# Altium schematic sheet Sensor.SchDoc
size A3; SheetNumber: 4; SheetTotal: 7
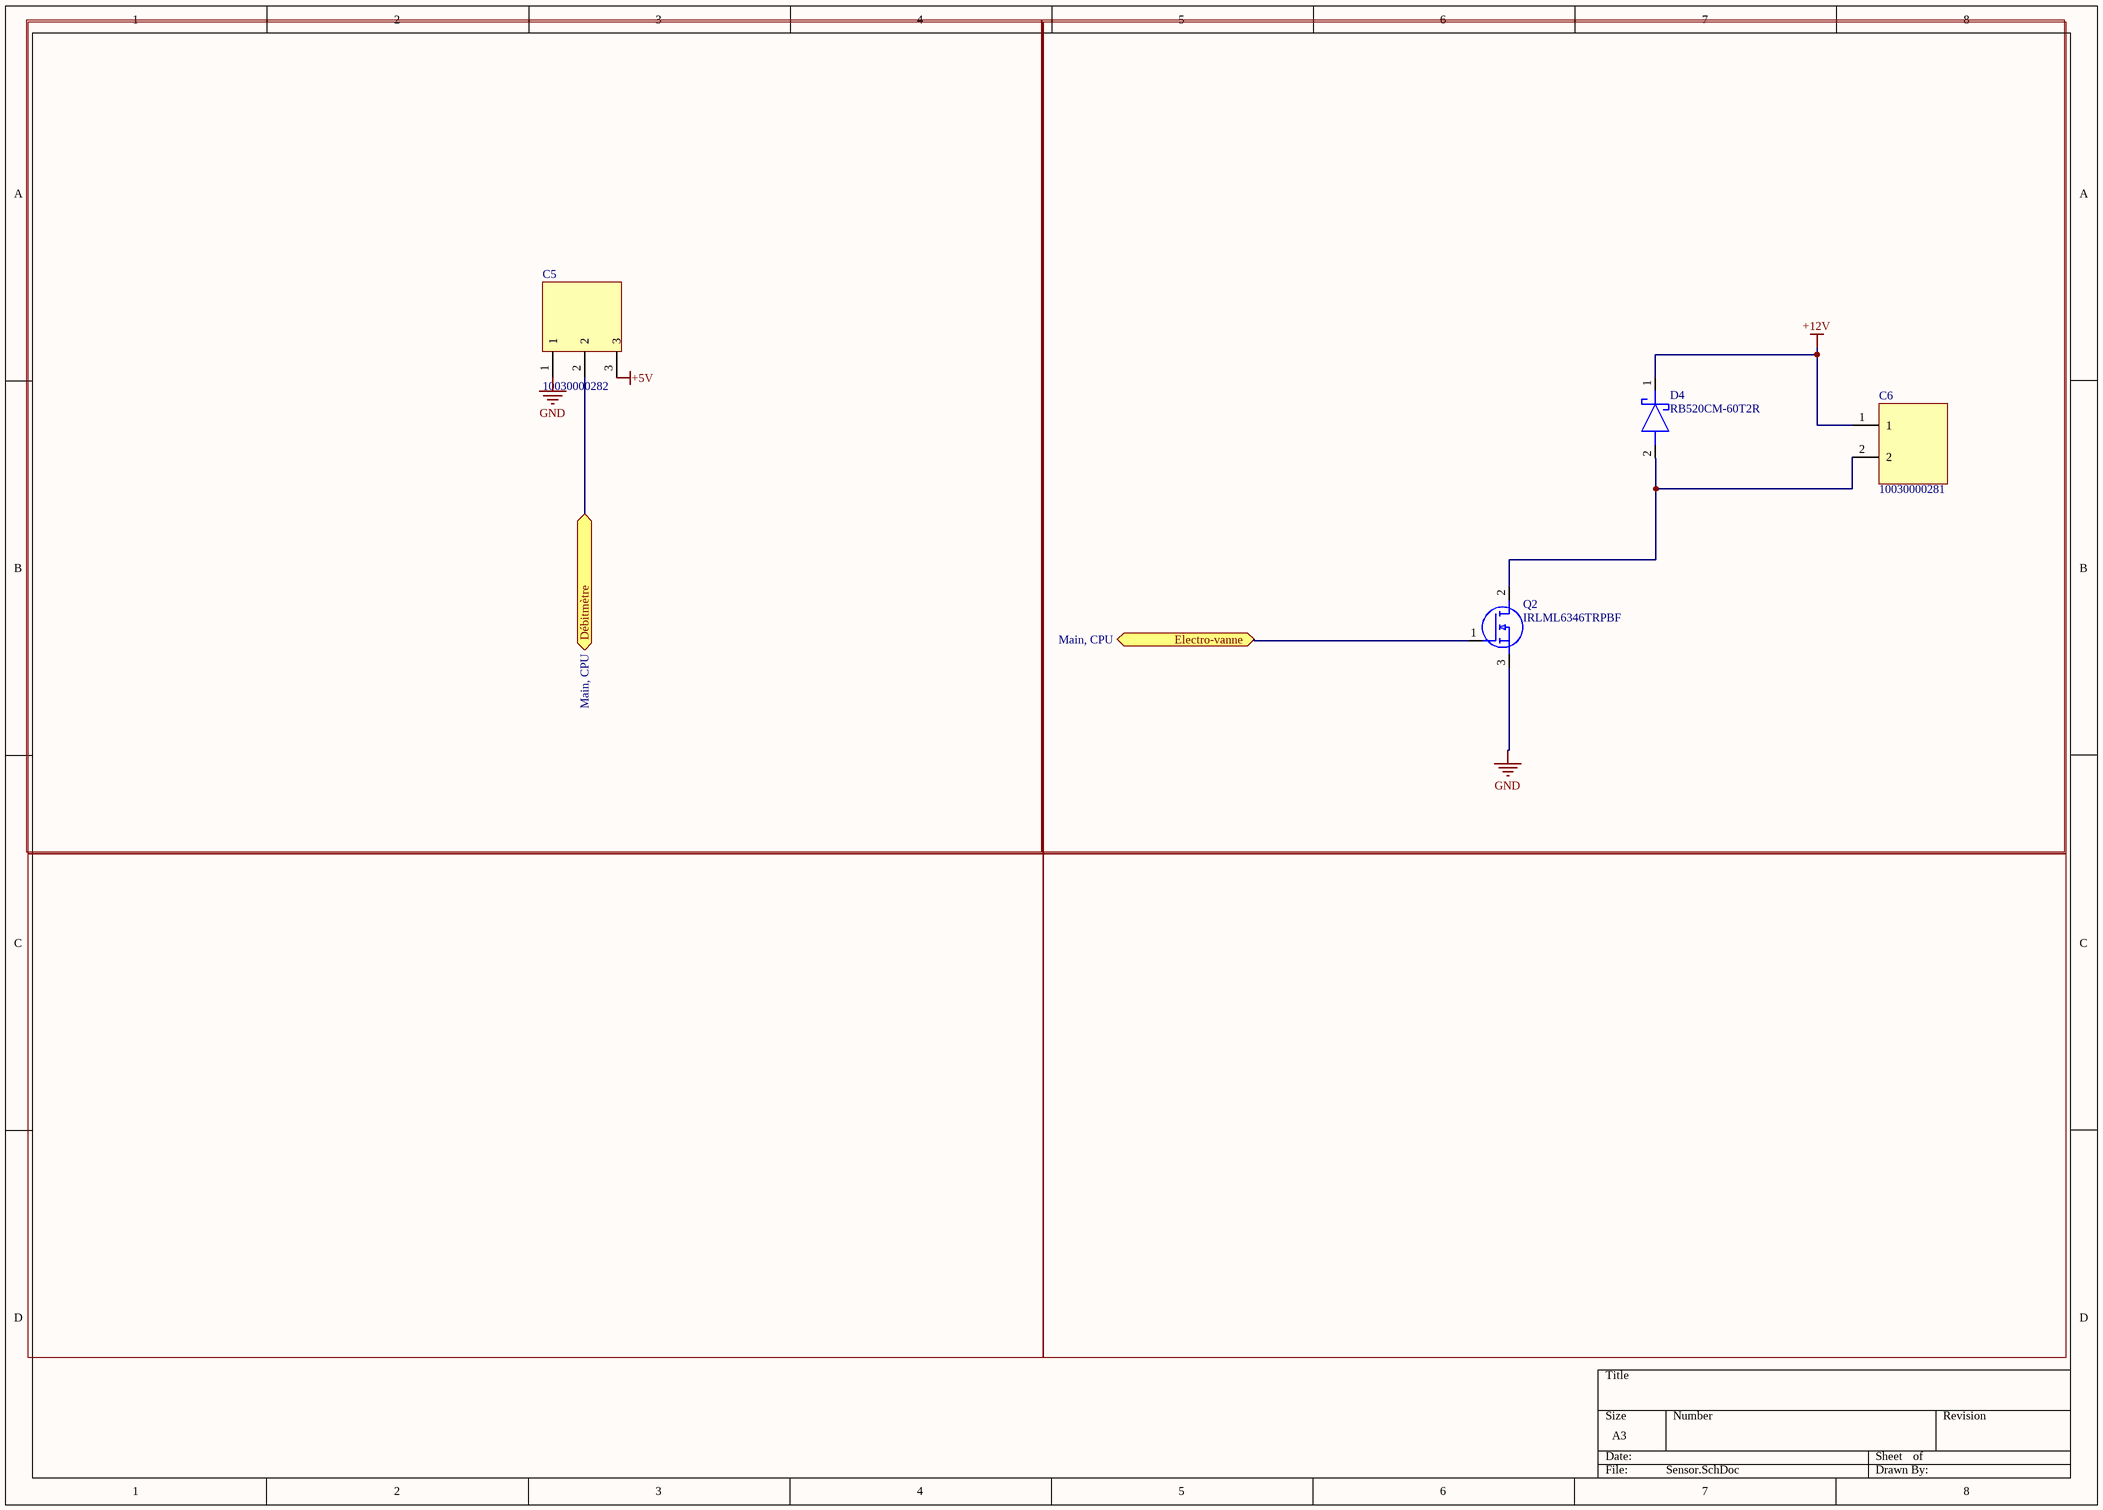
[diagram p0: Sensor.SchDoc]

## Parts
C5  10030000282  [15EDGRC-5.08-03P-10030000282]
C6  10030000281  [5EDGRHC-7.62-02P-10020000939]
D4  RB520CM-60T2R  [1SS400CSFHT2RA]
Q2  IRLML6346TRPBF  [SOT95P237X112-3N]

## Ports
Débitmètre (bidir, see Main, CPU), Electro-vanne (bidir, see Main, CPU)

## Nets
+5V: C5.3
+12V: C6.1 D4.1(K)
GND: C5.1 Q2.3(S)
Débitmètre: C5.2 ; port Débitmètre
Electro-vanne: Q2.1(G) ; port Electro-vanne
NetC6_2: C6.2 D4.2(A) Q2.2(D)

## Library data of the parts
C5 = 15EDGRC-5.08-03P: Pluggable Terminal Blocksnominal current7A.Rated voltage(Ⅱ/2)：450V,pitch:5.08mm,Color:green,Contact surface:Tin
C6 = 5EDGRHC-7.62-02P: Pluggable Terminal Blocksnominal current7A.Rated voltage(Ⅱ/2)：450V,pitch:5.08mm,Color:green,Contact surface:Tin
D4 = RB520CM-60T2R: Schottky Diode; Manufacturer_Name: ROHM Semiconductor; Datasheet Link: https://datasheet.datasheetarchive.com/originals/distributors/DKDS-18/356751.pdf; Height: 0.4mm; Manufacturer_Part_Number: RB520CM-60T2R; Mouser Part Number: 755-RB520CM-60T2R; Mouser Price/Stock: https://www.mouser.co.uk/ProductDetail/ROHM-Semiconductor/RB520CM-60T2R?qs=%2FKR40Cd6GUpWo9GUBmk4zQ%3D%3D
Q2 = IRLML6346TRPBF: MOSFET MOSFT 3.4A 63mOhm 30V 2.5V drv capable; Manufacturer_Name: Infineon; Manufacturer_Part_Number: IRFR2905ZTRPBF; Geometry.Height: 2.52mm; Mouser Part Number: 942-IRLML6346TRPBF; Mouser Price/Stock: https://www.mouser.co.uk/ProductDetail/Infineon-IR/IRFR2905ZTRPBF?qs=Z8%252BeY1k3TIIasKM0WUX9RA%3D%3D; Datasheet Link: https://www.infineon.com/dgdl/irfr2905zpbf.pdf?fileId=5546d462533600a401535630e7222088